# EAGLE design NodeEssential.v2.cg2 (EAGLE 4.16)
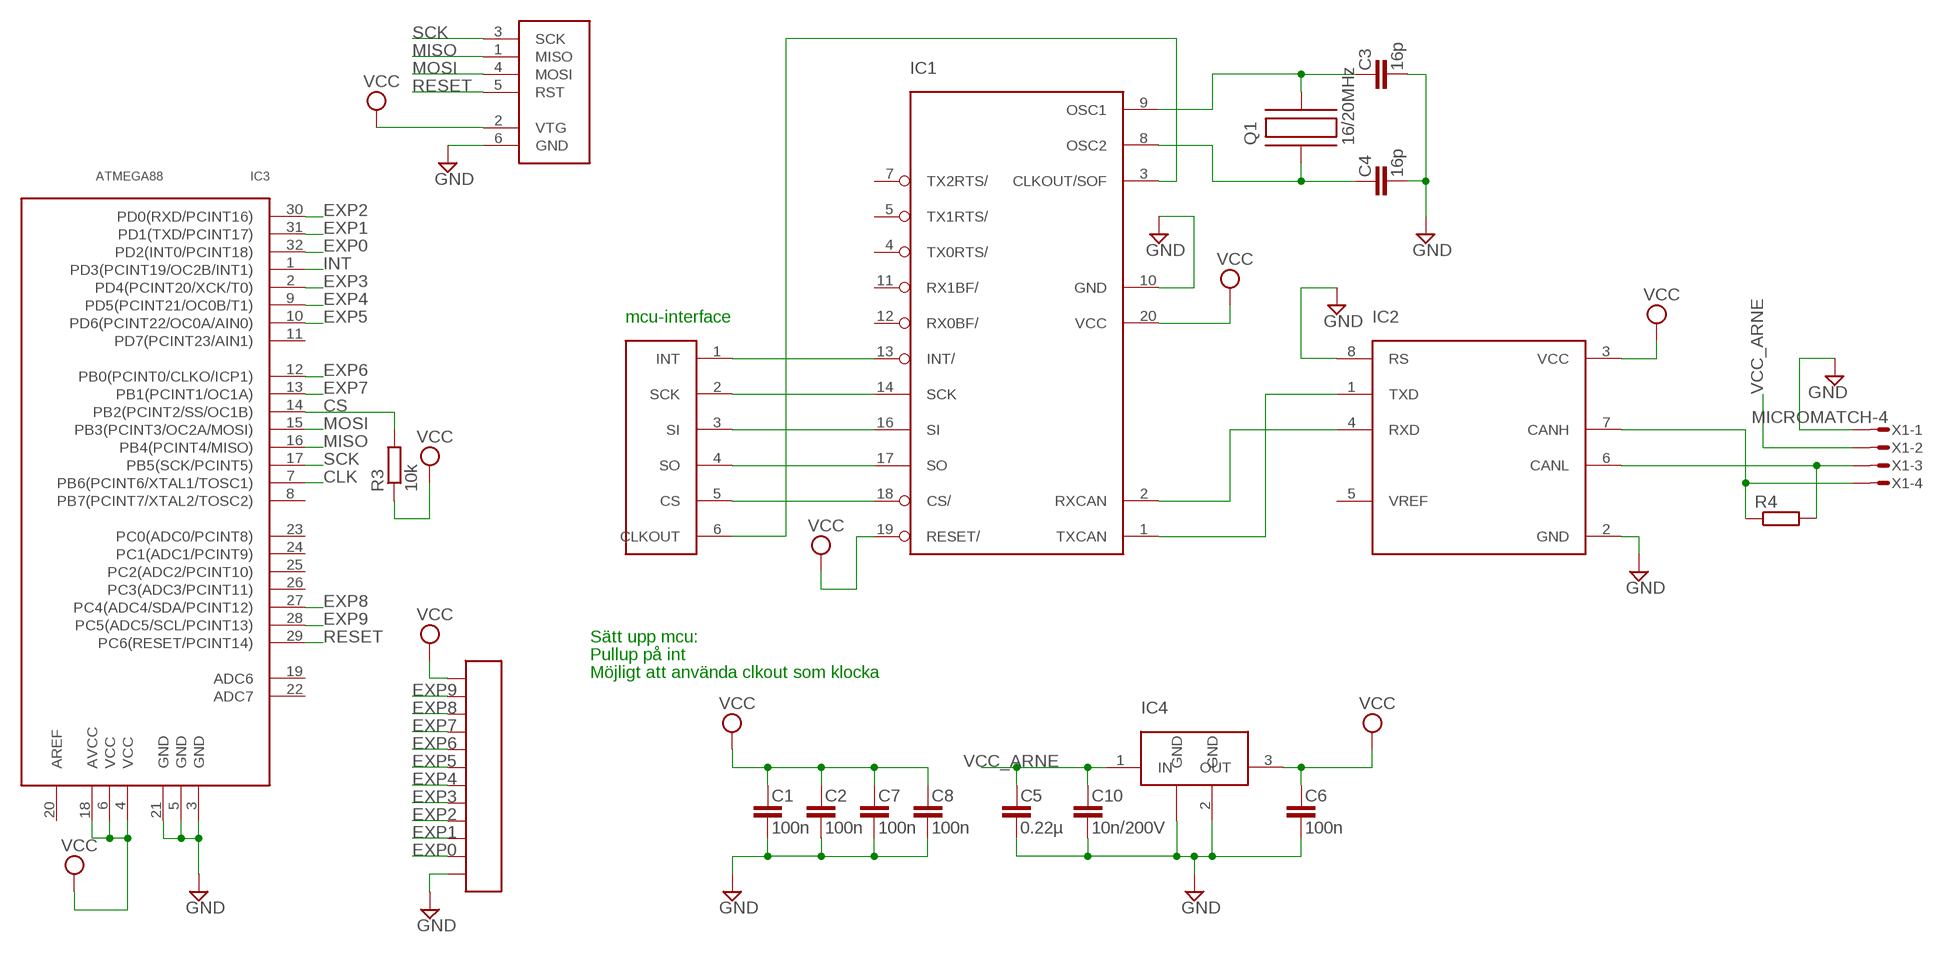
[diagram p0: schematic, sheet 1]

## Parts
C1  100n  C-EU  [C0603]
C2  100n  C-EU  [C0603]
C3  16p  C-EU  [C0603]
C4  16p  C-EU  [C0603]
C5  0.22µ  C-EU  [C0603]
C6  100n  C-EU  [C0603]
C7  100n  C-EU  [C0603]
C8  100n  C-EU  [C0603]
C10  10n/200V  C-EU  [C0603]
IC1  MCP2515  [TSSOP]
IC2  MCP2551  [SOIC]
IC3  ATMEGA88  [TQFP32]
IC4  LM340MP-5.0  [SOT223]
Q1  16/20MHz  C-MAC-LFA147E  [SMD]
R3  10k  R-EUR0603  [R0603]
R4  R-EUR0603  [R0603]
U$1  CAN-INTERFACE  [VIA-LIST]
U$3  COLUMN  [COLUMN]
X1  MICROMATCH-4  [MICROMATCH-4]
X2  AVRISP6PIN  [6PIN]

## Nets
CANH: IC2.7(CANH) R4.1 X1.4
CANL: IC2.6(CANL) R4.2 X1.3
CLK: IC1.3(CLKOUT/SOF) IC3.7(PB6(PCINT6/XTAL1/TOSC1)) U$1.6(CLKOUT)
CS: IC1.18(CS/) IC3.14(PB2(PCINT2/SS/OC1B)) R3.2 U$1.5(CS)
EXP0: IC3.32(PD2(INT0/PCINT18)) U$3.11
EXP1: IC3.31(PD1(TXD/PCINT17)) U$3.10
EXP2: IC3.30(PD0(RXD/PCINT16)) U$3.9
EXP3: IC3.2(PD4(PCINT20/XCK/T0)) U$3.8
EXP4: IC3.9(PD5(PCINT21/OC0B/T1)) U$3.7
EXP5: IC3.10(PD6(PCINT22/OC0A/AIN0)) U$3.6
EXP6: IC3.12(PB0(PCINT0/CLKO/ICP1)) U$3.5
EXP7: IC3.13(PB1(PCINT1/OC1A)) U$3.4
EXP8: IC3.27(PC4(ADC4/SDA/PCINT12)) U$3.3
EXP9: IC3.28(PC5(ADC5/SCL/PCINT13)) U$3.2
GND: C1.2 C2.2 C3.2 C4.2 C5.2 C6.2 C7.2 C8.2 C10.2 IC1.10(GND) IC2.2(GND) IC2.8(RS) IC3.3(GND) IC3.5(GND) IC3.21(GND) IC4.2(GND) IC4.4(GND) U$3.12 X1.1 X2.6(GND)
INT: IC1.13(INT/) IC3.1(PD3(PCINT19/OC2B/INT1)) U$1.1(INT)
MISO: IC1.17(SO) IC3.16(PB4(PCINT4/MISO)) U$1.4(SO) X2.1(MISO)
MOSI: IC1.16(SI) IC3.15(PB3(PCINT3/OC2A/MOSI)) U$1.3(SI) X2.4(MOSI)
N$1: IC1.2(RXCAN) IC2.4(RXD)
N$2: IC1.1(TXCAN) IC2.1(TXD)
N$12: C3.1 IC1.9(OSC1) Q1.P$2
N$13: C4.1 IC1.8(OSC2) Q1.P$1
RESET: IC3.29(PC6(RESET/PCINT14)) X2.5(RST)
SCK: IC1.14(SCK) IC3.17(PB5(SCK/PCINT5)) U$1.2(SCK) X2.3(SCK)
VCC: C1.1 C2.1 C6.1 C7.1 C8.1 IC1.19(RESET/) IC1.20(VCC) IC2.3(VCC) IC3.4(VCC) IC3.6(VCC) IC3.18(AVCC) IC4.3(OUT) R3.1 U$3.1 X2.2(VTG)
VCC_ARNE: C5.1 C10.1 IC4.1(IN) X1.2
Unconnected: IC1.4(TX0RTS/) IC1.5(TX1RTS/) IC1.7(TX2RTS/) IC1.11(RX1BF/) IC1.12(RX0BF/) IC2.5(VREF) IC3.8(PB7(PCINT7/XTAL2/TOSC2)) IC3.11(PD7(PCINT23/AIN1)) IC3.19(ADC6) IC3.20(AREF) IC3.22(ADC7) IC3.23(PC0(ADC0/PCINT8)) IC3.24(PC1(ADC1/PCINT9)) IC3.25(PC2(ADC2/PCINT10)) IC3.26(PC3(ADC3/PCINT11))

## Notes on the sheet
- mcu-interface
- Sätt upp mcu:
- Pullup på int
- Möjligt att använda clkout som klocka

## Library data of the parts
C1-C8 C10 = rcl:C-EU
IC1 = mcp2515:MCP2515
IC2 = mcp2551:MCP2551
IC3 = atmega88:ATMEGA88
IC4 = lm340mp:LM340MP-5.0
Q1 = hc49-4h-smx:C-MAC-LFA147E
R3 R4 = rcl:R-EU
U$1 = can-interface:CAN-INTERFACE
U$3 = expboard:COLUMN
X1 = con-amp-micromatch:MICROMATCH-4: MicroMaTch 4 7-215464-4 / 0-215464-4 Drawing Number C-215464 DDEController.pdf
X2 = avrisp:AVRISP6PIN

## Board
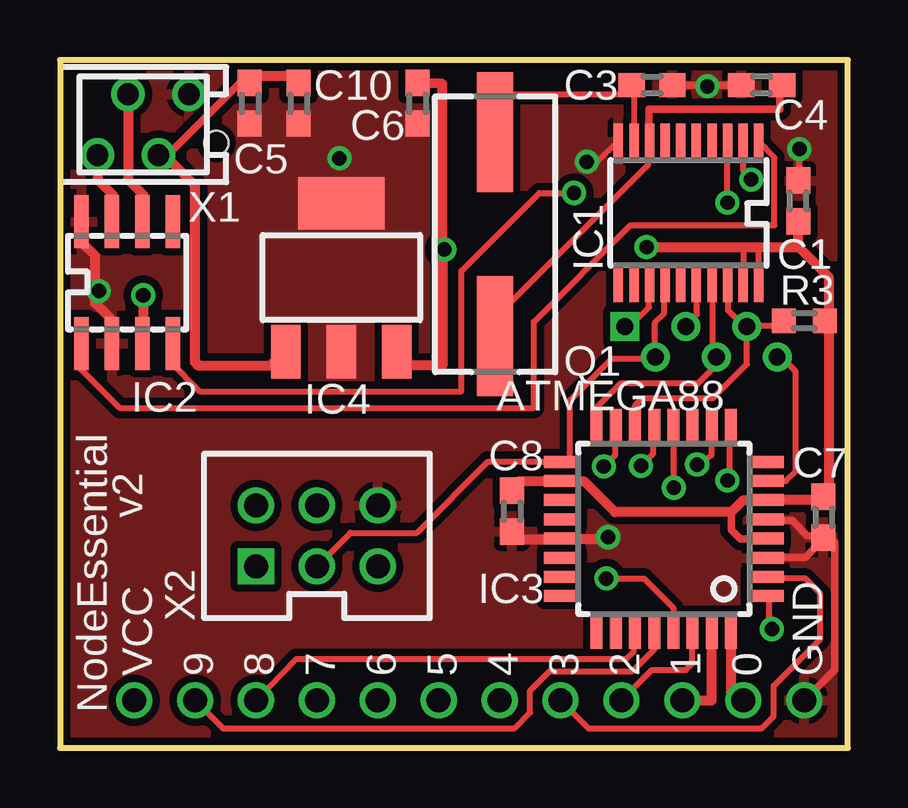
[diagram p1: board, top side]
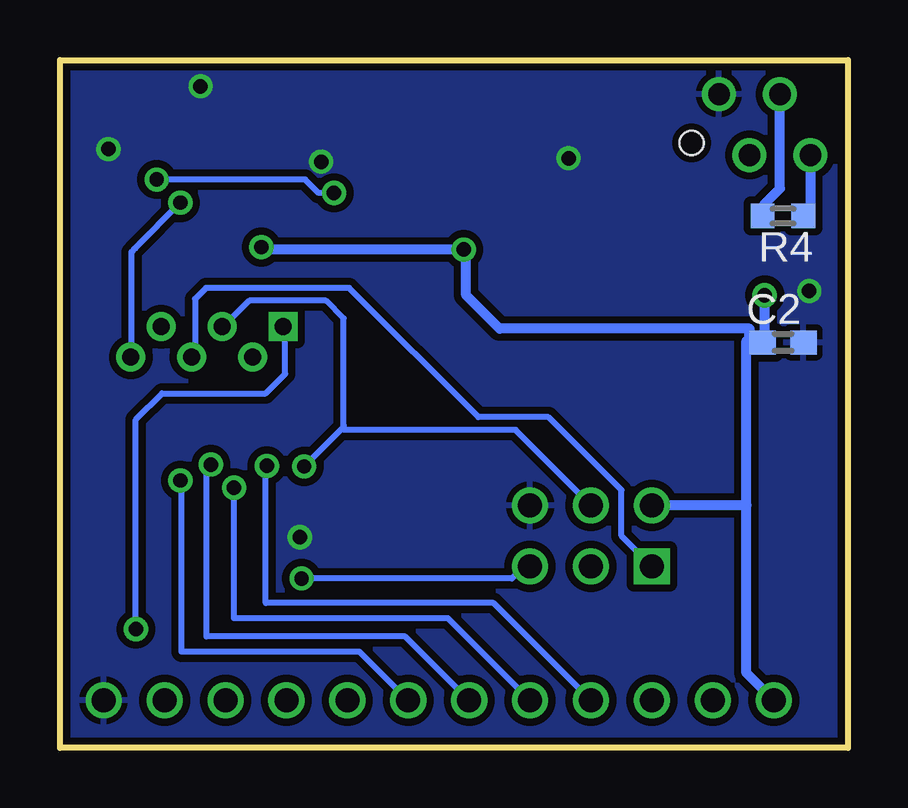
[diagram p2: board, bottom side, seen from below]

Size 32.85 x 28.68 mm. Coordinates in mm from the lower left corner, seen from the top.
Outline: 0,0 32.85,0 32.85,28.68 0,28.68 0,0
Copper layers (1*16): Top 0.035mm / dielectric 1.5mm / Bottom 0.035mm
Design rules "10mils, 0.6drill": minimum track width 10mil, minimum drill 0.6mm, track to track 10mil, track to pad 10mil, pad to pad 10mil, via to via 10mil, smd to smd 10mil, copper to edge 10mil, drill to drill 10mil, minimum pad ring 10mil, minimum via ring 8mil, stop-mask expansion 0mil, vias tented up to drill 0mil, thermal gap 10mil

### Footprints (pad centres in the part's own frame; a part is rotated, then mirrored left to right if it is on the bottom)
C0603 = smd 1.1 x 1: 1 -0.85,0; 2 0.85,0
TSSOP = smd 0.396 x 1.5: 1 -2.925,-2.975; 2 -2.275,-2.975; 3 -1.625,-2.975; 4 -0.975,-2.975; 5 -0.325,-2.975; 6 0.325,-2.975; 7 0.975,-2.975; 8 1.625,-2.975; 9 2.275,-2.975; 10 2.925,-2.975; 11 2.925,2.975; 12 2.275,2.975; 13 1.625,2.975; 14 0.975,2.975; 15 0.325,2.975; 16 -0.325,2.975; 17 -0.975,2.975; 18 -1.625,2.975; 19 -2.275,2.975; 20 -2.925,2.975
SOIC = smd 0.6 x 2.2: 1 -1.905,-2.54; 2 -0.635,-2.54; 3 0.635,-2.54; 4 1.905,-2.54; 5 1.905,2.54; 6 0.635,2.54; 7 -0.635,2.54; 8 -1.905,2.54
TQFP32 = smd 1.5 x 0.5: 1 -4.25,2.65; 2 -4.25,1.85; 3 -4.25,1.05; 4 -4.25,0.25; 5 -4.25,-0.55; 6 -4.25,-1.35; 7 -4.25,-2.15; 8 -4.25,-2.95; 17 4.25,-2.95; 18 4.25,-2.15; 19 4.25,-1.35; 20 4.25,-0.55; 21 4.25,0.25; 22 4.25,1.05; 23 4.25,1.85; 24 4.25,2.65 | smd 0.5 x 1.5: 9 -2.8,-4.4; 10 -2,-4.4; 11 -1.2,-4.4; 12 -0.4,-4.4; 13 0.4,-4.4; 14 1.2,-4.4; 15 2,-4.4; 16 2.8,-4.4; 25 2.8,4.1; 26 2,4.1; 27 1.2,4.1; 28 0.4,4.1; 29 -0.4,4.1; 30 -1.2,4.1; 31 -2,4.1; 32 -2.8,4.1
SOT223 = smd 1.219 x 2.235: 1 -2.311,-3.099; 2 0,-3.099; 3 2.311,-3.099 | smd 3.6 x 2.2: 4 0,3.099
SMD = smd 5 x 1.5: P$1 4.25,0; P$2 -4.25,0
R0603 = smd 0.991 x 1.016: 1 -0.85,0; 2 0.85,0
VIA-LIST = drill 0.7 square: 1 0,2.54 | drill 0.7 round: 2 -1.27,1.27; 3 0,0; 4 -1.27,-1.27; 5 0,-2.54; 6 -1.27,-3.81
COLUMN12SIMPLE = drill 1 round: 1 0,15.24; 2 0,12.7; 3 0,10.16; 4 0,7.62; 5 0,5.08; 6 0,2.54; 7 0,0; 8 0,-2.54; 9 0,-5.08; 10 0,-7.62; 11 0,-10.16; 12 0,-12.7
MICROMATCH-4 = drill 0.9 round: 1 1.905,1.27; 2 0.635,-1.27; 3 -0.635,1.27; 4 -1.905,-1.27 | hole 1: 3.048,-0.762
6PIN = drill 1 square: 1 -1.27,2.54 | drill 1 round: 2 1.27,2.54; 3 -1.27,0; 4 1.27,0; 5 -1.27,-2.54; 6 1.27,-2.54

### Placement (x,y rotation side)
C1  30.78,22.81 90 top
C2  2.7,16.9 0 bottom
C3  24.68,27.64 0 top
C4  29.25,27.64 180 top
C5  7.92,26.87 270 top
C6  14.9,26.87 270 top
C7  31.83,9.62 270 top
C8  18.84,9.87 270 top
C10  9.95,26.87 270 top
IC1  26.21,22.3 180 top
IC2  2.8,19.4 0 top
IC3  25.17,8.98 180 top
IC4  11.73,19.61 0 top
Q1  18.14,21.42 270 top
R3  31.03,17.81 180 top
R4  2.71,22.17 180 bottom
U$1  26.09,17.56 90 top
U$3  COLUMN  [COLUMN12SIMPLE]  18.33,1.98 90 top
X1  3.47,25.98 0 top
X2  10.71,8.84 90 top

### Tracks (layer width: path | path; a pad name or v marks a point on that pad's centre or on a via)
CANH
  Top 0.406: IC2.7 2.2,21.97 2.2,23.06 1.57,23.7 X1.4
  Bottom 0.406: R4.1 1.57,22.47 X1.4
CANL
  Top 0.406: IC2.6 3.47,21.97 3.47,23.06 2.84,23.7 X1.3
  Bottom 0.406: R4.2 3.47,22.26 3.47,22.68 2.84,23.32 X1.3
CLK  (via drill 0.6)
  Top 0.254: v27.83,22.73 27.83,24.66 IC1.3 | IC3.7 30.27,11.13 30.67,11.53 30.67,15.7 30.17,16.21 29.96,16.21 29.96,16.23 U$1.6
  Bottom 0.254: v27.83,22.73 29.71,20.83 29.86,20.68 29.86,16.31 29.88,16.31 U$1.6
CS
  Top 0.254: IC1.18 27.86,19.31 27.86,18.24 28.62,17.48 28.62,17.19 U$1.5 | U$1.5 28.62,17.17 28.82,17.6 29.87,17.6 R3.2 | IC3.14 23.97,14.28 24.27,14.58 27.22,14.58 28.64,16 28.64,17.55 U$1.5
EXP0
  Top 0.406: 27.98,4.5 27.98,4.52 | 27.98,4.5 IC3.32 | U$3.11 27.98,1.98 27.98,4.5
EXP1
  Top 0.406: IC3.31 27.17,4.5 27.17,1.98 U$3.10
EXP2
  Top 0.254: U$3.9 24.68,3.25 26.1,3.25 26.36,3.51 26.36,4.48 IC3.30
EXP3
  Top 0.254: U$3.8 22.04,0.81 29.25,0.81 29.76,1.32 29.76,2.59 31.69,4.52 31.69,6.45 31.08,7.06 29.46,7.06 29.46,7.1 IC3.2
EXP4  (via drill 0.6)
  Top 0.254: v27.83,11.15 27.93,11.35 27.93,13.28 27.98,13.34 27.97,13.34 IC3.9
  Bottom 0.254: v27.83,11.15 27.78,11.2 27.78,4.01 20.36,4.01 U$3.7
EXP5  (via drill 0.6)
  Top 0.254: v26.56,11.81 27.17,12.22 27.17,13.34 IC3.10
  Bottom 0.254: v26.56,11.81 26.76,11.76 26.74,11.63 26.74,4.65 18.46,4.65 U$3.6
EXP6  (via drill 0.6)
  Top 0.254: IC3.12 25.59,13.36 v25.59,10.85
  Bottom 0.254: v25.59,10.85 25.59,5.41 16.68,5.41 U$3.5
EXP7  (via drill 0.6)
  Top 0.254: IC3.13 24.73,13.34 24.73,12.27 v24.22,11.76
  Bottom 0.254: v24.22,11.76 24.2,11.91 24.27,11.63 24.27,6.05 14.77,6.05 U$3.4
EXP8
  Top 0.254: U$3.3 9.85,3.71 23.61,3.71 23.92,4.01 23.92,4.42 23.97,4.48 IC3.27
EXP9
  Top 0.254: 24.77,4.53 24.73,4.57 | 24.77,4.53 IC3.28 | U$3.2 6.8,0.81 18.94,0.81 19.6,1.47 19.6,2.39 20.41,3.2 23.87,3.2 24.78,4.12 24.77,4.12 24.77,4.53
GND  (via drill 0.6)
  Top 0.254: v21.96,24.44 22.39,24.44 IC1.10 | v30.83,24.97 30.83,24.23 C1.2 | 1.46,18.54 v1.62,19.05 | 20.56,8.69 IC3.21 21.28,8.71 | C8.2 19.09,8.69 | 22.83,8.71 v22.85,8.79
  Top 0.305: IC2.2 2.07,17.2 | 26.97,27.64 C4.2 | 26.97,27.64 26.97,27.59 v26.99,27.59 | C3.2 26.97,27.64 | IC3.5 29.48,9.48 30.52,9.48 31.16,8.84 31.35,8.84 C7.2 31.72,8.88 | IC3.3 29.45,7.95 31.08,7.95 31.72,8.59 | 31.72,8.88 31.61,8.94 | 31.72,8.59 31.72,8.88 | 31.72,8.59 32.3,8.59 32.3,3.25 U$3.12
  Top 0.406: 2.07,17.2 2.07,17.93 1.46,18.54 1.46,20.52 0.96,21.03 IC2.8 | 19.09,8.69 20.56,8.69 | 21.28,8.71 22.83,8.71
  other vias: 11.65,24.58
  pour Bottom (isolate 0.305): 0.12,28.58 32.83,28.58 32.83,0.1 24.38,0.1 0.12,0.1
  pour Top (isolate 0.305, no thermals): 6.19,28.08 15.89,28.08 15.89,15.03 6.19,15.03
  pour Top (isolate 0.305): 0.17,28.52 32.68,28.52 32.68,0.2 0.17,0.2
INT  (via drill 0.6)
  Top 0.254: IC1.13 24.55,19.3 24.55,18.36 23.54,17.35 23.54,17.19 U$1.1 | 29.63,5.08 v29.68,4.95 29.56,5.39 29.56,6.35 29.44,6.35 IC3.1
  Bottom 0.254: v29.68,4.95 29.68,13.69 28.59,14.78 24.27,14.78 23.46,15.6 23.46,17.53 23.51,17.53 U$1.1
MISO
  Top 0.254: IC3.16 22.29,13.69 22.29,14.12 23.36,15.19 26.58,15.19 27.32,15.93 27.32,16.21 27.31,16.21 | U$1.4 27.31,16.21 | 27.31,16.21 27.22,16.05 27.22,19.29 IC1.17
  Bottom 0.254: X2.1 9.44,8.84 9.44,10.74 12.49,13.79 15.41,13.79 20.79,19.18 26.76,19.18 27.22,18.72 27.22,15.95 27.35,15.82 27.35,15.9 U$1.4
MOSI  (via drill 0.6)
  Top 0.254: v22.67,11.74 23.16,12.22 23.16,13.36 IC3.15 | IC1.16 26.56,19.36 26.56,18.09 26.08,17.6 26.08,17.19 U$1.3
  Bottom 0.254: 21.02,13.46 21.04,13.45 | 21.02,13.46 21.02,17.91 21.76,18.64 24.96,18.64 25.87,17.73 26.08,17.6 U$1.3 | 21.02,13.39 21.02,13.46 | X2.4 13.86,13.26 21.02,13.26 21.02,13.39 | 21.02,13.39 v22.67,11.74
N$1  (via drill 0.6)
  Top 0.254: v21.43,23.14 19.98,23.14 16.73,19.89 16.73,14.86 5.83,14.86 4.61,16.08 4.61,16.77 IC2.4 | v28.82,23.7 28.49,24.03 IC1.2
  Bottom 0.254: v21.43,23.14 22.06,23.14 22.62,23.7 v28.82,23.7
N$2
  Top 0.254: IC2.1 0.88,15.77 2.48,14.17 19.75,14.17 19.75,17.75 23.79,21.79 29.79,21.79 29.79,24.6 IC1.1
N$12
  Top 0.254: IC1.9 23.87,25.63 23.92,25.63 23.92,27.25 | C3.1 23.92,27.64 23.92,27.25 | Q1.P$2 18.2,25.03 18.2,27.25 23.92,27.25
N$13
  Top 0.254: IC1.8 24.53,24.66 24.53,24.31 18.38,18.16 18.38,17.98 Q1.P$1
  Top 0.305: IC1.8 24.55,25.16 24.55,26.62 30.01,26.62 30.01,27.64 C4.1
RESET  (via drill 0.6)
  Top 0.254: IC3.29 25.57,4.5 25.57,5.84 24.35,7.06 v22.77,7.06
  Bottom 0.254: v22.77,7.06 14.01,7.06 13.5,7.57 X2.5
SCK
  Top 0.254: X2.3 12.11,8.97 14.88,8.97 17.85,11.94 20.72,11.94 20.88,11.89 IC3.17 21.25,12.12 21.25,14.48 23,16.23 24.58,16.23 24.6,16.21 24.81,16.21 | IC1.14 25.19,19.29 25.19,18.11 24.81,17.73 24.81,16.21 | U$1.2 24.81,15.92 24.81,16.21
VCC  (via drill 0.6, 0.61)
  Top 0.254: 29.81,10.34 IC3.6 29.05,10.34 | 21.28,11.1 IC3.18 | IC1.20 29.12,19.45 29.12,20.88 29.68,20.88 | 28.49,19.38 28.48,19.39 IC1.19 28.49,19.45 28.49,19.38 | 28.49,20.88 28.49,19.38 | R3.1 31.88,17.82 32.05,17.98 32.05,19.63 | 30.84,21.98 30.84,21.96 30.78,21.9
  Top 0.305: IC3.4 29.41,8.71 28.36,8.71 27.98,9.09 27.98,9.83
  Top 0.406: C6.1 15.95,27.69 15.95,20.78 | 15.95,20.78 15.95,15.94 14.08,15.94 14.08,16.76 IC4.3 | v16.02,20.78 15.95,20.78 | v24.45,20.88 28.49,20.88 29.68,20.88 | 29.68,20.88 | IC3.18 20.56,11.1 19.09,11.1 C8.1 | 29.81,10.34 31.61,10.34 C7.1 31.54,10.69 32.05,10.31 32.05,12.4 | 21.28,11.1 21.86,11.1 23.13,9.83 27.98,9.83 28.46,10.31 29.05,10.31 29.05,10.34 | 30.78,22.05 30.84,21.98 | 29.68,20.88 30.78,20.88 30.78,20.91 | 30.78,20.91 30.78,21.9 C1.1 | 32.05,12.4 32.05,12.43 | 32.05,12.4 32.05,19.63 30.78,20.91 | IC2.3 3.46,16.84 3.47,16.84 v3.47,18.87
  Bottom 0.406: v24.45,20.88 24.4,20.88 24.3,20.78 v16.02,20.78 15.92,20.78 15.92,18.87 14.52,17.48 4.11,17.48 4.11,16.97 | U$3.1 4.23,3.12 4.23,10.11 | 4.23,10.11 4.23,16.97 4.11,16.97 | 4.23,10.11 X2.2 | 3.49,16.97 3.47,16.97 | 3.49,16.97 C2.1 3.47,16.98 v3.47,18.87 | 4.11,16.97 3.49,16.97
VCC_ARNE
  Top 0.305: C5.1 7.84,27.81 | 9.31,16.51 IC4.1 | 7.92,27.89 7.66,27.89 4.49,24.71 4.23,24.71 X1.2
  Top 0.406: C10.1 9.95,28.02 7.92,28.02 7.92,27.89 C5.1 | 9.31,16.51 8.76,15.95 5.76,15.95 5.63,16.08 5.63,23.45 4.49,24.59 4.23,24.59 4.23,24.71

### Text on the board
tPlace: v2 | VCC | 9 | 8 | 7 | 6 | 5 | 4 | 3 | 2 | 1 | 0 | GND | NodeEssential